# Altium project roach2_project rev2.PrjPCB (part 4 of 13)

## Sheet ppc_extbus.SchDoc: PowerPC External Bus Interfaces
size A3; Date: DO NOT USE, RATHER USE PROJ OPTIONS; DrawnBy: DO NOT USE, RATHER USE PROJ OPTIONS; Engineer: DO NOT USE, RATHER USE PROJ OPTIONS; Organization: DO NOT USE, RATHER USE PROJ OPTIONS; DocumentNumber: DO NOT USE, RATHER USE PROJ OPTIONS; Revision: DO NOT USE, RATHER USE PROJ OPTIONS; SheetNumber: 6; SheetTotal: 27; SCH_Sheet_Filename: ppc_extbus.SchDoc; CurrentTime: DO NOT USE, RATHER USE PROJ OPTIONS; Time: DO NOT USE, RATHER USE PROJ OPTIONS; DocumentFullPathAndName: DO NOT USE, RATHER USE PROJ OPTIONS; DocumentName: DO NOT USE, RATHER USE PROJ OPTIONS; ModifiedDate: DO NOT USE, RATHER USE PROJ OPTIONS; ImagePath: DO NOT USE, RATHER USE PROJ OPTIONS
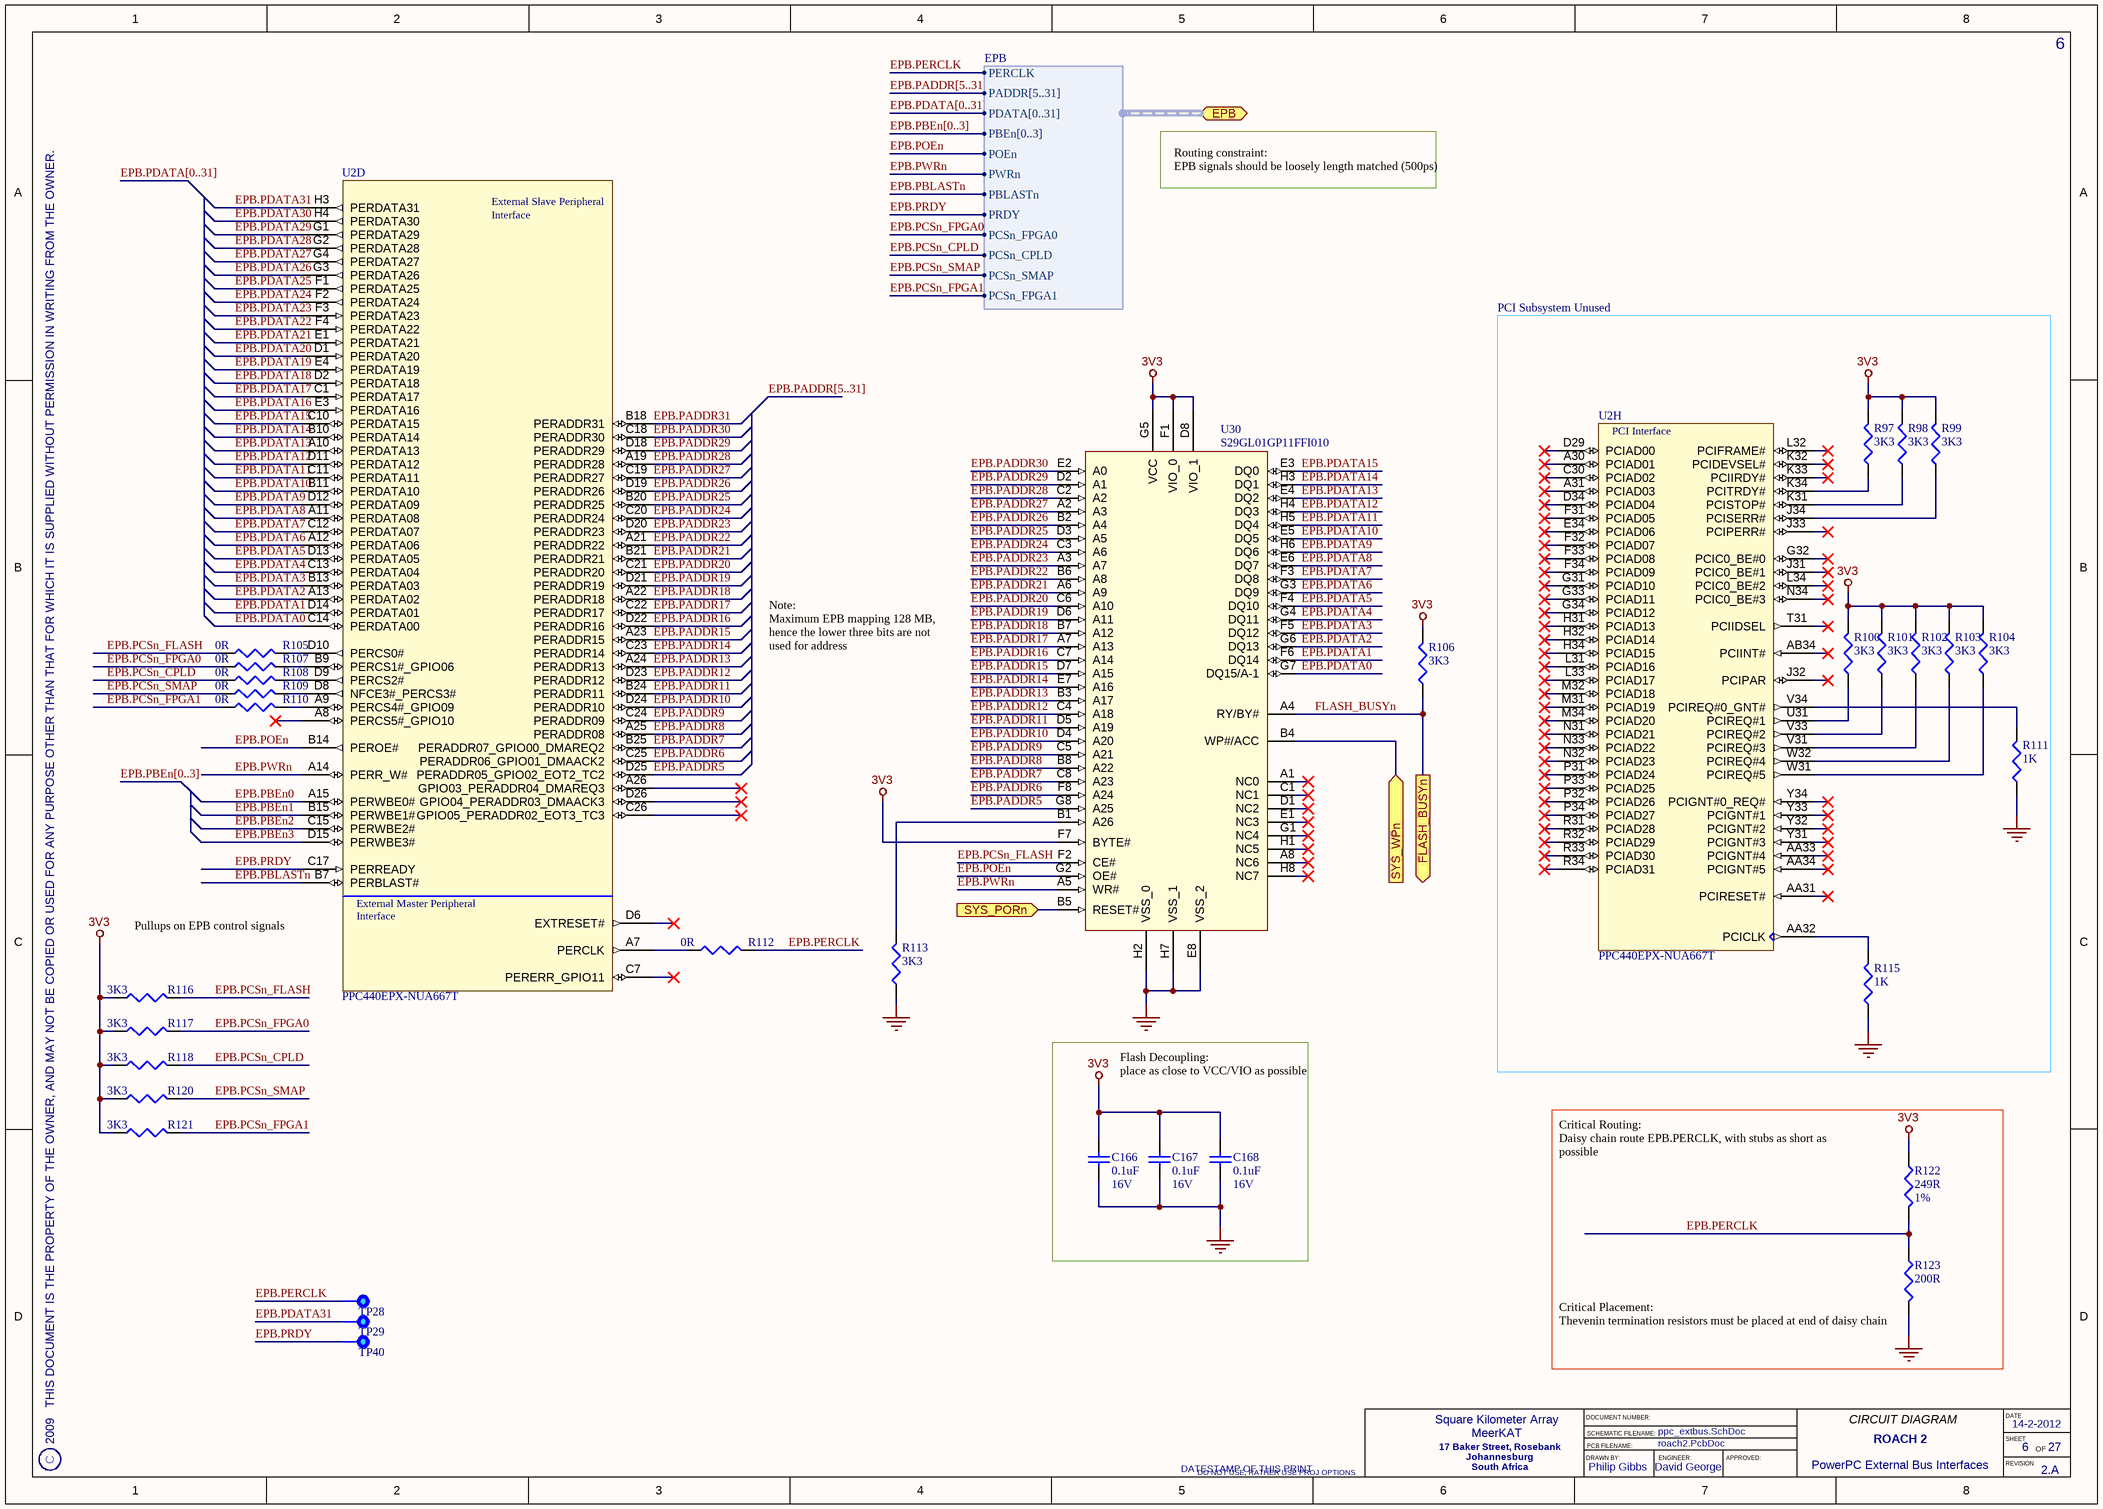
[diagram p7: ppc_extbus.SchDoc]

### Parts
C166  Rating: 16V  [CAPC1005X60L]  (hidden comment: 0.1uF)
C167  Rating: 16V  [CAPC1005X60L]  (hidden comment: 0.1uF)
C168  Rating: 16V  [CAPC1005X60L]  (hidden comment: 0.1uF)
R97  3K3  [RESC1005X40L]
R98  3K3  [RESC1005X40L]
R99  3K3  [RESC1005X40L]
R100  3K3  [RESC1005X40L]
R101  3K3  [RESC1005X40L]
R102  3K3  [RESC1005X40L]
R103  3K3  [RESC1005X40L]
R104  3K3  [RESC1005X40L]
R105  0R  [RESC1005X40L]
R106  3K3  [RESC1005X40L]
R107  0R  [RESC1005X40L]
R108  0R  [RESC1005X40L]
R109  0R  [RESC1005X40L]
R110  0R  [RESC1005X40L]
R111  1K  [RESC1005X40L]
R112  0R  [RESC1005X40L]
R113  3K3  [RESC1005X40L]
R115  1K  [RESC1005X40L]
R116  3K3  [RESC1005X40L]
R117  3K3  [RESC1005X40L]
R118  3K3  [RESC1005X40L]
R120  3K3  [RESC1005X40L]
R121  3K3  [RESC1005X40L]
R122  Tolerance: 1%  [RESC1005X40L]  (hidden comment: 249R)
R123  200R  [RESC1005X40L]
TP28  Testpoint  [TP100]  (value not drawn)  (no BOM)
TP29  Testpoint  [TP100]  (value not drawn)  (no BOM)
TP40  Testpoint  [TP100]  (value not drawn)  (no BOM)
U2  PPC440EPX-NUA667T  [TE-PBGA680]  (parts D,H of 11)
U30  S29GL01GP11FFI010  [LAA064]

### Blocks framed on the sheet
PCI Subsystem Unused: R97-R104 R111 R115 U2

### Ports
EPB (harness EPB), FLASH_BUSYn (out), SYS_PORn (in), SYS_WPn (in)

### Harnesses
EPB: PERCLK, PADDR[5..31], PDATA[0..31], PBEn[0..3], POEn, PWRn, PBLASTn, PRDY, PCSn_FPGA0, PCSn_CPLD, PCSn_SMAP, PCSn_FPGA1

### Nets
3V3: C166.2 C167.2 C168.2 R97.2 R98.2 R99.2 R100.2 R101.2 R102.2 R103.2 R104.2 R106.2 R116.1 R117.1 R118.1 R120.1 R121.1 R122.1 U30.D8(VIO_1) U30.F1(VIO_0) U30.F7(BYTE#) U30.G5(VCC)
GND: C166.1 C167.1 C168.1 R111.1 R113.1 R115.1 R123.2 U30.E8(VSS_2) U30.H2(VSS_0) U30.H7(VSS_1)
EPB.PADDR5: U2.D25(PERADDR05_GPIO02_EOT2_TC2) U30.G8(A25)
EPB.PADDR6: U2.C25(PERADDR06_GPIO01_DMAACK2) U30.F8(A24)
EPB.PADDR7: U2.B25(PERADDR07_GPIO00_DMAREQ2) U30.C8(A23)
EPB.PADDR8: U2.A25(PERADDR08) U30.B8(A22)
EPB.PADDR9: U2.C24(PERADDR09) U30.C5(A21)
EPB.PADDR10: U2.D24(PERADDR10) U30.D4(A20)
EPB.PADDR11: U2.B24(PERADDR11) U30.D5(A19)
EPB.PADDR12: U2.D23(PERADDR12) U30.C4(A18)
EPB.PADDR13: U2.A24(PERADDR13) U30.B3(A17)
EPB.PADDR14: U2.C23(PERADDR14) U30.E7(A16)
EPB.PADDR15: U2.A23(PERADDR15) U30.D7(A15)
EPB.PADDR16: U2.D22(PERADDR16) U30.C7(A14)
EPB.PADDR17: U2.C22(PERADDR17) U30.A7(A13)
EPB.PADDR18: U2.A22(PERADDR18) U30.B7(A12)
EPB.PADDR19: U2.D21(PERADDR19) U30.D6(A11)
EPB.PADDR20: U2.C21(PERADDR20) U30.C6(A10)
EPB.PADDR21: U2.B21(PERADDR21) U30.A6(A9)
EPB.PADDR22: U2.A21(PERADDR22) U30.B6(A8)
EPB.PADDR23: U2.D20(PERADDR23) U30.A3(A7)
EPB.PADDR24: U2.C20(PERADDR24) U30.C3(A6)
EPB.PADDR25: U2.B20(PERADDR25) U30.D3(A5)
EPB.PADDR26: U2.D19(PERADDR26) U30.B2(A4)
EPB.PADDR27: U2.C19(PERADDR27) U30.A2(A3)
EPB.PADDR28: U2.A19(PERADDR28) U30.C2(A2)
EPB.PADDR29: U2.D18(PERADDR29) U30.D2(A1)
EPB.PADDR30: U2.C18(PERADDR30) U30.E2(A0)
EPB.PADDR31: U2.B18(PERADDR31)
EPB.PBEn0: U2.A15(PERWBE0#)
EPB.PBEn1: U2.B15(PERWBE1#)
EPB.PBEn2: U2.C15(PERWBE2#)
EPB.PBEn3: U2.D15(PERWBE3#)
EPB.PBLASTn: U2.B7(PERBLAST#) ; port EPB.PBLASTn
EPB.PCSn_CPLD: R108.1 R118.2 ; port EPB.PCSn_CPLD
EPB.PCSn_FLASH: R105.1 R116.2 U30.F2(CE#)
EPB.PCSn_FPGA0: R107.1 R117.2 ; port EPB.PCSn_FPGA0
EPB.PCSn_FPGA1: R110.1 R121.2 ; port EPB.PCSn_FPGA1
EPB.PCSn_SMAP: R109.1 R120.2 ; port EPB.PCSn_SMAP
EPB.PDATA0: U2.C14(PERDATA00) U30.G7(DQ15/A-1)
EPB.PDATA1: U2.D14(PERDATA01) U30.F6(DQ14)
EPB.PDATA2: U2.A13(PERDATA02) U30.G6(DQ13)
EPB.PDATA3: U2.B13(PERDATA03) U30.F5(DQ12)
EPB.PDATA4: U2.C13(PERDATA04) U30.G4(DQ11)
EPB.PDATA5: U2.D13(PERDATA05) U30.F4(DQ10)
EPB.PDATA6: U2.A12(PERDATA06) U30.G3(DQ9)
EPB.PDATA7: U2.C12(PERDATA07) U30.F3(DQ8)
EPB.PDATA8: U2.A11(PERDATA08) U30.E6(DQ7)
EPB.PDATA9: U2.D12(PERDATA09) U30.H6(DQ6)
EPB.PDATA10: U2.B11(PERDATA10) U30.E5(DQ5)
EPB.PDATA11: U2.C11(PERDATA11) U30.H5(DQ4)
EPB.PDATA12: U2.D11(PERDATA12) U30.H4(DQ3)
EPB.PDATA13: U2.A10(PERDATA13) U30.E4(DQ2)
EPB.PDATA14: U2.B10(PERDATA14) U30.H3(DQ1)
EPB.PDATA15: U2.C10(PERDATA15) U30.E3(DQ0)
EPB.PDATA16: U2.E3(PERDATA16)
EPB.PDATA17: U2.C1(PERDATA17)
EPB.PDATA18: U2.D2(PERDATA18)
EPB.PDATA19: U2.E4(PERDATA19)
EPB.PDATA20: U2.D1(PERDATA20)
EPB.PDATA21: U2.E1(PERDATA21)
EPB.PDATA22: U2.F4(PERDATA22)
EPB.PDATA23: U2.F3(PERDATA23)
EPB.PDATA24: U2.F2(PERDATA24)
EPB.PDATA25: U2.F1(PERDATA25)
EPB.PDATA26: U2.G3(PERDATA26)
EPB.PDATA27: U2.G4(PERDATA27)
EPB.PDATA28: U2.G2(PERDATA28)
EPB.PDATA29: U2.G1(PERDATA29)
EPB.PDATA30: U2.H4(PERDATA30)
EPB.PDATA31: TP29.1 U2.H3(PERDATA31)
EPB.PERCLK: R112.2 R122.2 R123.1 TP28.1 ; port EPB.PERCLK
EPB.POEn: U2.B14(PEROE#) U30.G2(OE#) ; port EPB.POEn
EPB.PRDY: TP40.1 U2.C17(PERREADY) ; port EPB.PRDY
EPB.PWRn: U2.A14(PERR_W#) U30.A5(WR#) ; port EPB.PWRn
FLASH_BUSYn: R106.1 U30.A4(RY/BY#) ; port FLASH_BUSYn
SYS_PORn: U30.B5(RESET#) ; port SYS_PORn
SYS_WPn: U30.B4(WP#/ACC) ; port SYS_WPn
NetR97_1: R97.1 U2.K34(PCITRDY#)
NetR98_1: R98.1 U2.K31(PCISTOP#)
NetR99_1: R99.1 U2.J34(PCISERR#)
NetR100_1: R100.1 U2.U31(PCIREQ#1)
NetR101_1: R101.1 U2.V33(PCIREQ#2)
NetR102_1: R102.1 U2.V31(PCIREQ#3)
NetR103_1: R103.1 U2.W32(PCIREQ#4)
NetR104_1: R104.1 U2.W31(PCIREQ#5)
NetR105_2: R105.2 U2.D10(PERCS0#)
NetR107_2: R107.2 U2.B9(PERCS1#_GPIO06)
NetR108_2: R108.2 U2.D9(PERCS2#)
NetR109_2: R109.2 U2.D8(NFCE3#_PERCS3#)
NetR110_2: R110.2 U2.A9(PERCS4#_GPIO09)
NetR111_2: R111.2 U2.V34(PCIREQ#0_GNT#)
NetR112_1: R112.1 U2.A7(PERCLK)
NetR113_2: R113.2 U30.B1(A26)
NetR115_2: R115.2 U2.AA32(PCICLK)

Not connected (* = marked no-connect by the designer): U2 A8(PERCS5#_GPIO10)* A26(GPIO03_PERADDR04_DMAREQ3)* A30(PCIAD01)* A31(PCIAD03)* AA31(PCIRESET#)* AA33(PCIGNT#4)* AA34(PCIGNT#5)* AB34(PCIINT#)* C7(PERERR_GPIO11)* C26(GPIO05_PERADDR02_EOT3_TC3)* C30(PCIAD02)* D6(EXTRESET#)* D26(GPIO04_PERADDR03_DMAACK3)* D29(PCIAD00)* D34(PCIAD04)* E34(PCIAD06)* F31(PCIAD05)* F32(PCIAD07)* F33(PCIAD08)* F34(PCIAD09)* G31(PCIAD10)* G32(PCIC0_BE#0)* G33(PCIAD11)* G34(PCIAD12)* H31(PCIAD13)* H32(PCIAD14)* H34(PCIAD15)* J31(PCIC0_BE#1)* J32(PCIPAR)* J33(PCIPERR#)* K32(PCIDEVSEL#)* K33(PCIIRDY#)* L31(PCIAD16)* L32(PCIFRAME#)* L33(PCIAD17)* L34(PCIC0_BE#2)* M31(PCIAD19)* M32(PCIAD18)* M34(PCIAD20)* N31(PCIAD21)* N32(PCIAD23)* N33(PCIAD22)* N34(PCIC0_BE#3)* P31(PCIAD24)* P32(PCIAD26)* P33(PCIAD25)* P34(PCIAD27)* R31(PCIAD28)* R32(PCIAD29)* R33(PCIAD30)* R34(PCIAD31)* T31(PCIIDSEL)* Y31(PCIGNT#3)* Y32(PCIGNT#2)* Y33(PCIGNT#1)* Y34(PCIGNT#0_REQ#)*; U30 A1(NC0)* A8(NC6)* C1(NC1)* D1(NC2)* E1(NC3)* G1(NC4)* H1(NC5)* H8(NC7)*

### Buses and harness runs
bus EPB.PADDR[5..31]
bus EPB.PBEn[0..3]
bus EPB.PDATA[0..31]

### Notes on the sheet
- Routing constraint:
  EPB signals should be loosely length matched (500ps)
- Note:
  Maximum EPB mapping 128 MB,
  hence the lower three bits are not
  used for address
- (near U2) Pullups on EPB control signals
- Flash Decoupling:
  place as close to VCC/VIO as possible
- (near R122) Critical Routing:
  Daisy chain route EPB.PERCLK, with stubs as short as possible
- (near R123) Critical Placement:
  Thevenin termination resistors must be placed at end of daisy chain
- 2009   THIS DOCUMENT IS THE PROPERTY OF THE OWNER, AND MAY NOT BE COPIED OR USED FOR ANY PURPOSE OTHER THAN THAT FOR WHICH IT IS SUPPLIED WITHOUT PERMISSION IN WRITING FROM THE OWNER.
- C
- DATESTAMP OF THIS PRINT
- DRAWN BY:
- DOCUMENT NUMBER:
- SCHEMATIC FILENAME:
- PCB FILENAME:
- ENGINEER:
- APPROVED:
- CIRCUIT DIAGRAM
- DATE
- SHEET
- REVISION
- OF
- (in symbol IC-CPU-1, part D) External Slave Peripheral; Interface; External Master Peripheral
- (in symbol IC-CPU-1, part H) PCI Interface

### Library data of the parts
C166-C168 = CAP-CER-1: 0.1uF, Ceramic Capacitor; Manufacturer: VENKEL; PartNum: C0402X7R160-104KN; Tolerance: 10%; Dielectric: X7R; POD number: CAP-CER-1; RoHS: Y; Value: 0.1uF; Sort Value: 0.1; Category: Capacitors; Subcategory: Ceramic
R97-R104 R106 R113 R116-R118 R120 R121 = RES-TF-7: 3K3, 1.1mm x 0.5mm, Thick Film Resistor; Manufacturer: ROYALOHM; PartNum: 0402WGJ0332T1E; Tolerance: 5%; Rating: 0.0625W; POD number: RES-TF-7; Value: 3K3; Sort Value: 3300; Category: Resistors; Subcategory: ThickFilm; HelpURL: *.pdf
R105 R107-R110 R112 = RES-TF-0: 0R, 1.1mm x 0.5mm, Thick Film Resistor; Manufacturer: ROYALOHM; PartNum: 0402WG00000T1E; Tolerance: 0%; Rating: 0.0625W; POD number: RES-TF-0; Value: 0R; Sort Value: 0; Category: Resistors; Subcategory: ThickFilm; HelpURL: *.pdf
R111 R115 = RES-TF-8: 1K, 1.1mm x 0.5mm, Thick Film Resistor; Manufacturer: ROYALOHM; PartNum: 0402WGJ0102T1E; Tolerance: 5%; Rating: 0.0625W; POD number: RES-TF-8; Value: 1K; Sort Value: 1000; Category: Resistors; Subcategory: ThickFilm; HelpURL: *.pdf
R122 = RES-TF-15: 249R, 1.1mm x 0.5mm, Thick Film Resistor; Manufacturer: ROYALOHM; PartNum: 0402WGF2490T1E; Rating: 0.0625W; POD number: RES-TF-15; Value: 249R; Sort Value: 249; Category: Resistors; Subcategory: ThickFilm; HelpURL: *.pdf
R123 = RES-TF-19: 200R, 1.1mm x 0.5mm, Thick Film Resistor; Manufacturer: ROYALOHM; PartNum: 0402WGF0201T1E; Tolerance: 1%; Rating: 0.0625W; POD number: RES-TF-19; Value: 200R; Sort Value: 200; Category: Resistors; Subcategory: ThickFilm; HelpURL: *.pdf
TP28 TP29 TP40 = ELMECH-TP-0: 1mm Diameter, through-hole, Circular Test-point; POD number: ELMECH-TP-0; RoHS: Y; Category: ELMECH; Subcategory: Test Points
U2 = IC-CPU-1: 667MHz, non-RoHS, PPC440EPx uProcessor; Manufacturer: Applied Micro; POD number: IC-CPU-1; PartNum: PPC440EPX-NUA667T; RoHS: Y; Category: IC; Subcategory: CPU
U30 = IC-MEM-0: 3V, 1 Gigabit NOR Flash; Manufacturer: Spansion; POD number: IC-MEM-0; PartNum: S29GL01GP11FFI010; RoHS: Y; Category: IC; Subcategory: Memory

## Sheet ppc_net.SchDoc: PowePC Gigabit Ethernet
size A3; Date: DO NOT USE, RATHER USE PROJ OPTIONS; DrawnBy: DO NOT USE, RATHER USE PROJ OPTIONS; Engineer: DO NOT USE, RATHER USE PROJ OPTIONS; Organization: DO NOT USE, RATHER USE PROJ OPTIONS; DocumentNumber: DO NOT USE, RATHER USE PROJ OPTIONS; Revision: DO NOT USE, RATHER USE PROJ OPTIONS; SheetNumber: 11; SheetTotal: 29; SCH_Sheet_Filename: ppc_net.SchDoc; CurrentTime: DO NOT USE, RATHER USE PROJ OPTIONS; Time: DO NOT USE, RATHER USE PROJ OPTIONS; DocumentFullPathAndName: DO NOT USE, RATHER USE PROJ OPTIONS; DocumentName: DO NOT USE, RATHER USE PROJ OPTIONS; ModifiedDate: DO NOT USE, RATHER USE PROJ OPTIONS; ImagePath: DO NOT USE, RATHER USE PROJ OPTIONS
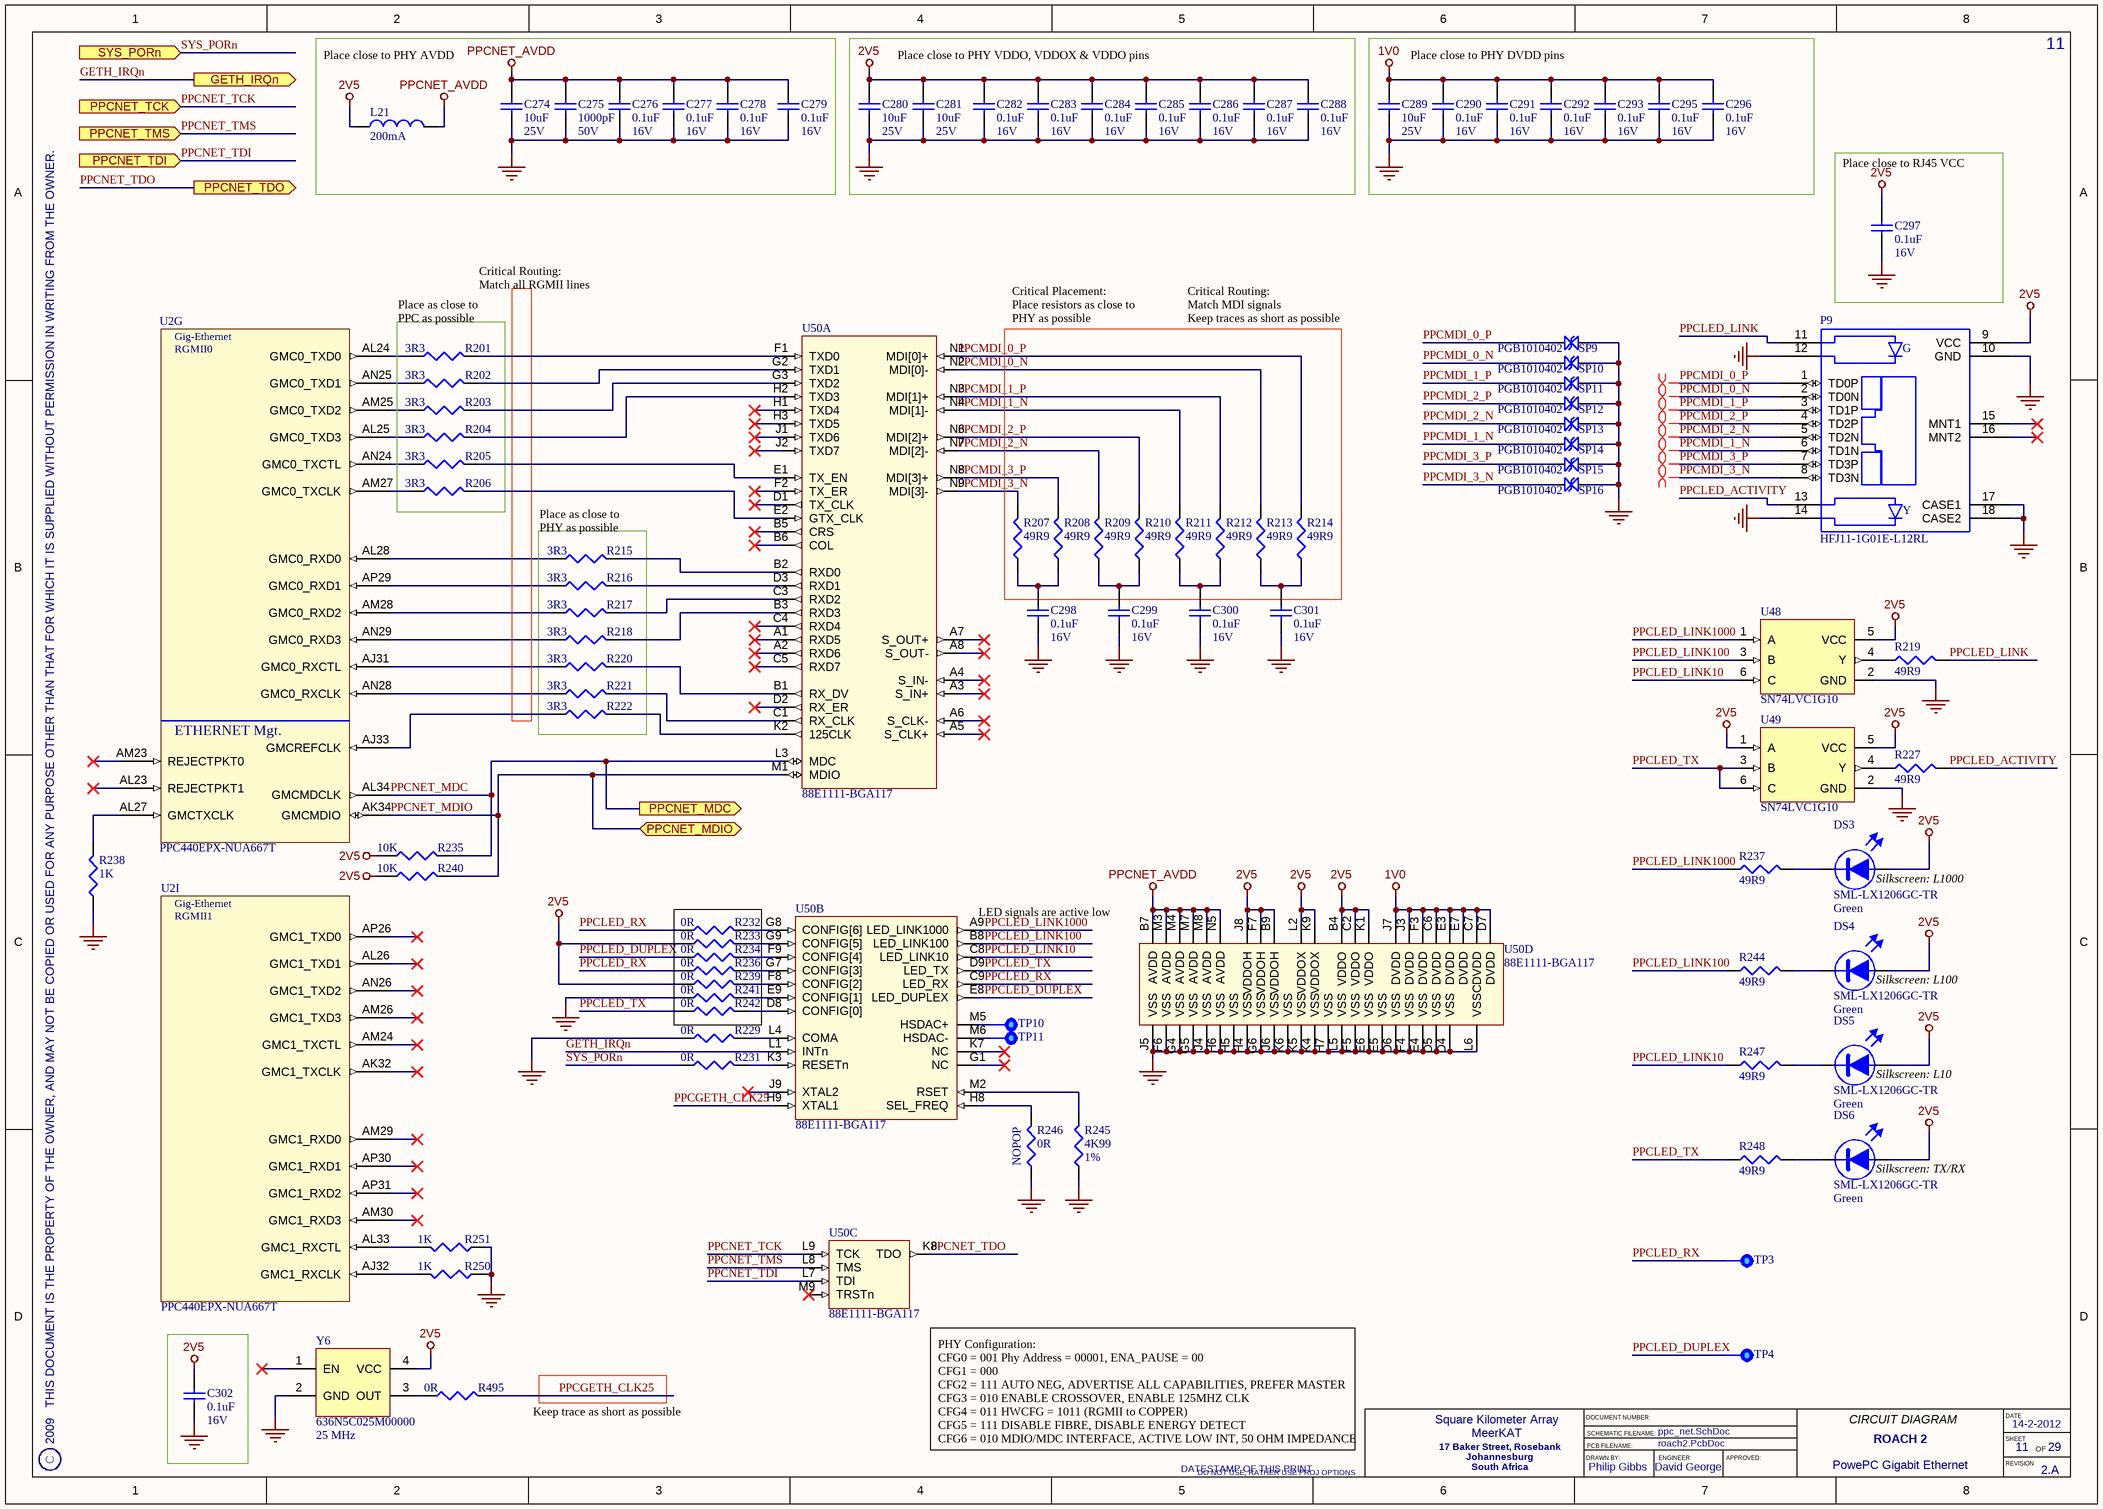
[diagram p8: ppc_net.SchDoc]

### Parts
C274  Rating: 25V  [CAPC3225X200L]  (hidden comment: 10uF)
C275  Rating: 50V  [CAPC1005X55L]  (hidden comment: 1000pF)
C276  Rating: 16V  [CAPC1005X60L]  (hidden comment: 0.1uF)
C277  Rating: 16V  [CAPC1005X60L]  (hidden comment: 0.1uF)
C278  Rating: 16V  [CAPC1005X60L]  (hidden comment: 0.1uF)
C279  Rating: 16V  [CAPC1005X60L]  (hidden comment: 0.1uF)
C280  Rating: 25V  [CAPC3225X200L]  (hidden comment: 10uF)
C281  Rating: 25V  [CAPC3225X200L]  (hidden comment: 10uF)
C282  Rating: 16V  [CAPC1005X60L]  (hidden comment: 0.1uF)
C283  Rating: 16V  [CAPC1005X60L]  (hidden comment: 0.1uF)
C284  Rating: 16V  [CAPC1005X60L]  (hidden comment: 0.1uF)
C285  Rating: 16V  [CAPC1005X60L]  (hidden comment: 0.1uF)
C286  Rating: 16V  [CAPC1005X60L]  (hidden comment: 0.1uF)
C287  Rating: 16V  [CAPC1005X60L]  (hidden comment: 0.1uF)
C288  Rating: 16V  [CAPC1005X60L]  (hidden comment: 0.1uF)
C289  Rating: 25V  [CAPC3225X200L]  (hidden comment: 10uF)
C290  Rating: 16V  [CAPC1005X60L]  (hidden comment: 0.1uF)
C291  Rating: 16V  [CAPC1005X60L]  (hidden comment: 0.1uF)
C292  Rating: 16V  [CAPC1005X60L]  (hidden comment: 0.1uF)
C293  Rating: 16V  [CAPC1005X60L]  (hidden comment: 0.1uF)
C295  Rating: 16V  [CAPC1005X60L]  (hidden comment: 0.1uF)
C296  Rating: 16V  [CAPC1005X60L]  (hidden comment: 0.1uF)
C297  Rating: 16V  [CAPC1005X60L]  (hidden comment: 0.1uF)
C298  Rating: 16V  [CAPC1005X60L]  (hidden comment: 0.1uF)
C299  Rating: 16V  [CAPC1005X60L]  (hidden comment: 0.1uF)
C300  Rating: 16V  [CAPC1005X60L]  (hidden comment: 0.1uF)
C301  Rating: 16V  [CAPC1005X60L]  (hidden comment: 0.1uF)
C302  Rating: 16V  [CAPC1005X60L]  (hidden comment: 0.1uF)
DS3  SML-LX1206GC-TR  Colour: Green  [LEDC3216X120N]
DS4  SML-LX1206GC-TR  Colour: Green  [LEDC3216X120N]
DS5  SML-LX1206GC-TR  Colour: Green  [LEDC3216X120N]
DS6  SML-LX1206GC-TR  Colour: Green  [LEDC3216X120N]
L21  Rating: 200mA  [INDC2012X130L]  (hidden comment: 600R)
P9  HFJ11-1G01E-L12RL  [HALO_HFJ11-1G02E-L55]
R201  3R3  [RESC1005X40L]
R202  3R3  [RESC1005X40L]
R203  3R3  [RESC1005X40L]
R204  3R3  [RESC1005X40L]
R205  3R3  [RESC1005X40L]
R206  3R3  [RESC1005X40L]
R207  49R9  [RESC1005X40L]
R208  49R9  [RESC1005X40L]
R209  49R9  [RESC1005X40L]
R210  49R9  [RESC1005X40L]
R211  49R9  [RESC1005X40L]
R212  49R9  [RESC1005X40L]
R213  49R9  [RESC1005X40L]
R214  49R9  [RESC1005X40L]
R215  3R3  [RESC1005X40L]
R216  3R3  [RESC1005X40L]
R217  3R3  [RESC1005X40L]
R218  3R3  [RESC1005X40L]
R219  49R9  [RESC1005X40L]
R220  3R3  [RESC1005X40L]
R221  3R3  [RESC1005X40L]
R222  3R3  [RESC1005X40L]
R227  49R9  [RESC1005X40L]
R229  0R  [RESC1005X40L]
R231  0R  [RESC1005X40L]
R232  0R  [RESC1005X40L]
R233  0R  [RESC1005X40L]
R234  0R  [RESC1005X40L]
R235  10K  [RESC1005X40L]
R236  0R  [RESC1005X40L]
R237  49R9  [RESC1005X40L]
R238  1K  [RESC1005X40L]
R239  0R  [RESC1005X40L]
R240  10K  [RESC1005X40L]
R241  0R  [RESC1005X40L]
R242  0R  [RESC1005X40L]
R244  49R9  [RESC1005X40L]
R245  Tolerance: 1%  [RESC1005X40L]  (hidden comment: 4K99)
R246  0R  [RESC1005X40L]
R247  49R9  [RESC1005X40L]
R248  49R9  [RESC1005X40L]
R250  1K  [RESC1005X40L]
R251  1K  [RESC1005X40L]
R495  0R  [RESC1005X40L]
SP9  PGB1010402  [PGB1010402]
SP10  PGB1010402  [PGB1010402]
SP11  PGB1010402  [PGB1010402]
SP12  PGB1010402  [PGB1010402]
SP13  PGB1010402  [PGB1010402]
SP14  PGB1010402  [PGB1010402]
SP15  PGB1010402  [PGB1010402]
SP16  PGB1010402  [PGB1010402]
TP3  Testpoint  [TP100]  (value not drawn)  (no BOM)
TP4  Testpoint  [TP100]  (value not drawn)  (no BOM)
TP10  Testpoint  [TP100]  (value not drawn)  (no BOM)
TP11  Testpoint  [TP100]  (value not drawn)  (no BOM)
U2  PPC440EPX-NUA667T  [TE-PBGA680]  (parts G,I of 11)
U48  SN74LVC1G10  [SOT23-6]
U49  SN74LVC1G10  [SOT23-6]
U50  88E1111-BGA117  [BGA117C100P13X9_1400X1000X154]  (parts A,B,C,D of 4)
Y6  Frequency: 25 MHz  [636XXXXXXMXXXXX]  (hidden comment: 636N5C025M00000)

### Ports
GETH_IRQn (out), PPCNET_MDC (out), PPCNET_MDIO (bidir), PPCNET_TCK (in), PPCNET_TDI (in), PPCNET_TDO (out), PPCNET_TMS (in), SYS_PORn (in)

### Nets
1V0: C289.2 C290.2 C291.2 C292.2 C293.2 C295.2 C296.2 U50.C6(DVDD) U50.C7(DVDD) U50.D7(DVDD) U50.E3(DVDD) U50.E7(DVDD) U50.F3(DVDD) U50.J3(DVDD) U50.J7(DVDD)
2V5: C280.2 C281.2 C282.2 C283.2 C284.2 C285.2 C286.2 C287.2 C288.2 C297.2 C302.2 DS3.2(A) DS4.2(A) DS5.2(A) DS6.2(A) L21.1 P9.9(VCC) R233.1 R235.1 R239.1 R240.1 U48.5(VCC) U49.1(A) U49.5(VCC) U50.B4(VDDO) U50.B9(VDDOH) U50.C2(VDDO) U50.F7(VDDOH) U50.J8(VDDOH) U50.K1(VDDO) U50.K9(VDDOX) U50.L2(VDDOX) Y6.4(VCC)
GND: C274.1 C275.1 C276.1 C277.1 C278.1 C279.1 C280.1 C281.1 C282.1 C283.1 C284.1 C285.1 C286.1 C287.1 C288.1 C289.1 C290.1 C291.1 C292.1 C293.1 C295.1 C296.1 C297.1 C298.2 C299.2 C300.2 C301.2 C302.1 P9.10(GND) P9.12(R1_YA_GC) P9.14(L1_YA_GC) P9.17(CASE1) P9.18(CASE2) R229.1 R238.1 R241.1 R245.1 R246.1 R250.1 R251.1 SP9.1(A) SP10.1(A) SP11.1(A) SP12.1(A) SP13.1(A) SP14.1(A) SP15.1(A) SP16.1(A) U48.2(GND) U49.2(GND) U50.D4(VSS) U50.D5(VSS) U50.D6(VSS) U50.E4(VSS) U50.E5(VSS) U50.E6(VSS) U50.F4(VSS) U50.F5(VSS) U50.F6(VSS) U50.G4(VSS) U50.G5(VSS) U50.G6(VSS) U50.H4(VSS) U50.H5(VSS) U50.H6(VSS) U50.H7(VSS) U50.J4(VSS) U50.J5(VSS) U50.J6(VSS) U50.K4(VSS) U50.K5(VSS) U50.K6(VSS) U50.L5(VSS) U50.L6(VSSC) Y6.2(GND)
PPCNET_AVDD: C274.2 C275.2 C276.2 C277.2 C278.2 C279.2 L21.2 U50.B7(AVDD) U50.M3(AVDD) U50.M4(AVDD) U50.M7(AVDD) U50.M8(AVDD) U50.N5(AVDD)
GETH_IRQn: U50.L1(INTn) ; port GETH_IRQn
PPCGETH_CLK25: R495.2 U50.H9(XTAL1)
PPCLED_ACTIVITY: P9.13(L1_YC_GA) R227.2
PPCLED_DUPLEX: R234.1 TP4.1 U50.E8(LED_DUPLEX)
PPCLED_LINK: P9.11(R1_YC_GA) R219.2
PPCLED_LINK10: R247.1 U48.6(C) U50.C8(LED_LINK10)
PPCLED_LINK100: R244.1 U48.3(B) U50.B8(LED_LINK100)
PPCLED_LINK1000: R237.1 U48.1(A) U50.A9(LED_LINK1000)
PPCLED_RX: R232.1 R236.1 TP3.1 U50.C9(LED_RX)
PPCLED_TX: R242.1 R248.1 U49.3(B) U49.6(C) U50.D9(LED_TX)
PPCMDI_0_N: P9.2(TD0N) R213.2 SP10.2(B) U50.N2(MDI[0]-)
PPCMDI_0_P: P9.1(TD0P) R214.2 SP9.2(B) U50.N1(MDI[0]+)
PPCMDI_1_N: P9.6(TD1N) R211.2 SP14.2(B) U50.N4(MDI[1]-)
PPCMDI_1_P: P9.3(TD1P) R212.2 SP11.2(B) U50.N3(MDI[1]+)
PPCMDI_2_N: P9.5(TD2N) R209.2 SP13.2(B) U50.N7(MDI[2]-)
PPCMDI_2_P: P9.4(TD2P) R210.2 SP12.2(B) U50.N6(MDI[2]+)
PPCMDI_3_N: P9.8(TD3N) R207.2 SP16.2(B) U50.N9(MDI[3]-)
PPCMDI_3_P: P9.7(TD3P) R208.2 SP15.2(B) U50.N8(MDI[3]+)
PPCNET_MDC: R235.2 U2.AL34(GMCMDCLK) U50.L3(MDC) ; port PPCNET_MDC
PPCNET_MDIO: R240.2 U2.AK34(GMCMDIO) U50.M1(MDIO) ; port PPCNET_MDIO
PPCNET_TCK: U50.L9(TCK) ; port PPCNET_TCK
PPCNET_TDI: U50.L7(TDI) ; port PPCNET_TDI
PPCNET_TDO: U50.K8(TDO) ; port PPCNET_TDO
PPCNET_TMS: U50.L8(TMS) ; port PPCNET_TMS
SYS_PORn: R231.1 ; port SYS_PORn
NetC298_1: C298.1 R207.1 R208.1
NetC299_1: C299.1 R209.1 R210.1
NetC300_1: C300.1 R211.1 R212.1
NetC301_1: C301.1 R213.1 R214.1
NetDS3_1: DS3.1(K) R237.2
NetDS4_1: DS4.1(K) R244.2
NetDS5_1: DS5.1(K) R247.2
NetDS6_1: DS6.1(K) R248.2
NetR201_1: R201.1 U2.AL24(GMC0_TXD0)
NetR201_2: R201.2 U50.F1(TXD0)
NetR202_1: R202.1 U2.AN25(GMC0_TXD1)
NetR202_2: R202.2 U50.G2(TXD1)
NetR203_1: R203.1 U2.AM25(GMC0_TXD2)
NetR203_2: R203.2 U50.G3(TXD2)
NetR204_1: R204.1 U2.AL25(GMC0_TXD3)
NetR204_2: R204.2 U50.H2(TXD3)
NetR205_1: R205.1 U2.AN24(GMC0_TXCTL)
NetR205_2: R205.2 U50.E1(TX_EN)
NetR206_1: R206.1 U2.AM27(GMC0_TXCLK)
NetR206_2: R206.2 U50.E2(GTX_CLK)
NetR215_1: R215.1 U2.AL28(GMC0_RXD0)
NetR215_2: R215.2 U50.B2(RXD0)
NetR216_1: R216.1 U2.AP29(GMC0_RXD1)
NetR216_2: R216.2 U50.D3(RXD1)
NetR217_1: R217.1 U2.AM28(GMC0_RXD2)
NetR217_2: R217.2 U50.C3(RXD2)
NetR218_1: R218.1 U2.AN29(GMC0_RXD3)
NetR218_2: R218.2 U50.B3(RXD3)
NetR219_1: R219.1 U48.4(Y)
NetR220_1: R220.1 U2.AJ31(GMC0_RXCTL)
NetR220_2: R220.2 U50.B1(RX_DV)
NetR221_1: R221.1 U2.AN28(GMC0_RXCLK)
NetR221_2: R221.2 U50.C1(RX_CLK)
NetR222_1: R222.1 U2.AJ33(GMCREFCLK)
NetR222_2: R222.2 U50.K2(125CLK)
NetR227_1: R227.1 U49.4(Y)
NetR229_2: R229.2 U50.L4(COMA)
NetR231_2: R231.2 U50.K3(RESETn)
NetR232_2: R232.2 U50.G8(CONFIG[6])
NetR233_2: R233.2 U50.G9(CONFIG[5])
NetR234_2: R234.2 U50.F9(CONFIG[4])
NetR236_2: R236.2 U50.G7(CONFIG[3])
NetR238_2: R238.2 U2.AL27(GMCTXCLK)
NetR239_2: R239.2 U50.F8(CONFIG[2])
NetR241_2: R241.2 U50.E9(CONFIG[1])
NetR242_2: R242.2 U50.D8(CONFIG[0])
NetR245_2: R245.2 U50.M2(RSET)
NetR246_2: R246.2 U50.H8(SEL_FREQ)
NetR250_2: R250.2 U2.AJ32(GMC1_RXCLK)
NetR251_2: R251.2 U2.AL33(GMC1_RXCTL)
NetR495_1: R495.1 Y6.3(OUT)
NetTP10_1: TP10.1 U50.M5(HSDAC+)
NetTP11_1: TP11.1 U50.M6(HSDAC-)

Not connected (* = marked no-connect by the designer): P9 15(MNT1)* 16(MNT2)*; U2 AK32(GMC1_TXCLK)* AL23(REJECTPKT1)* AL26(GMC1_TXD1)* AM23(REJECTPKT0)* AM24(GMC1_TXCTL)* AM26(GMC1_TXD3)* AM29(GMC1_RXD0)* AM30(GMC1_RXD3)* AN26(GMC1_TXD2)* AP26(GMC1_TXD0)* AP30(GMC1_RXD1)* AP31(GMC1_RXD2)*; U50 A1(RXD5)* A2(RXD6)* A3(S_IN+)* A4(S_IN-)* A5(S_CLK+)* A6(S_CLK-)* A7(S_OUT+)* A8(S_OUT-)* B5(CRS)* B6(COL)* C4(RXD4)* C5(RXD7)* D1(TX_CLK)* D2(RX_ER)* F2(TX_ER)* G1(NC)* H1(TXD4)* H3(TXD5)* J1(TXD6)* J2(TXD7)* J9(XTAL2)* K7(NC)* M9(TRSTn)*; Y6 1(EN)*

### Layout directives
differential pair: PPCMDI_0_N, PPCMDI_0_P, PPCMDI_1_N, PPCMDI_1_P, PPCMDI_2_N, PPCMDI_2_P, PPCMDI_3_N, PPCMDI_3_P

### Notes on the sheet
- Place close to PHY AVDD
- Place close to PHY VDDO, VDDOX & VDDO pins
- Place close to PHY DVDD pins
- (near C297) Place close to RJ45 VCC
- (near R201) Place as close to
  PPC as possible
- Critical Routing:
  Match all RGMII lines
- Critical Placement:
  Place resistors as close to
  PHY as possible
- Critical Routing:
  Match MDI signals
  Keep traces as short as possible
- (near R215) Place as close to
  PHY as possible
- (near U50) LED signals are active low
- (near DS3) Silkscreen: L1000
- (near DS4) Silkscreen: L100
- (near DS5) Silkscreen: L10
- (near R246) NOPOP
- (near DS6) Silkscreen: TX/RX
- Keep trace as short as possible
- (near U50) PHY Configuration:
  CFG0 = 001 Phy Address = 00001, ENA_PAUSE = 00
  CFG1 = 000
  CFG2 = 111 AUTO NEG, ADVERTISE ALL CAPABILITIES, PREFER MASTER
  CFG3 = 010 ENABLE CROSSOVER, ENABLE 125MHZ CLK
  CFG4 = 011 HWCFG = 1011 (RGMII to COPPER)
  CFG5 = 111 DISABLE FIBRE, DISABLE ENERGY DETECT
  CFG6 = 010 MDIO/MDC INTERFACE, ACTIVE LOW INT, 50 OHM IMPEDANCE
- 2009   THIS DOCUMENT IS THE PROPERTY OF THE OWNER, AND MAY NOT BE COPIED OR USED FOR ANY PURPOSE OTHER THAN THAT FOR WHICH IT IS SUPPLIED WITHOUT PERMISSION IN WRITING FROM THE OWNER.
- C
- DATESTAMP OF THIS PRINT
- DRAWN BY:
- DOCUMENT NUMBER:
- SCHEMATIC FILENAME:
- PCB FILENAME:
- ENGINEER:
- APPROVED:
- CIRCUIT DIAGRAM
- DATE
- SHEET
- REVISION
- OF
- (in symbol CONN-PCB-4) G
- (in symbol IC-CPU-1, part G) Gig-Ethernet; RGMII0; ETHERNET Mgt.
- (in symbol IC-CPU-1, part I) Gig-Ethernet; RGMII1

### Library data of the parts
C274 C280 C281 C289 = CAP-CER-5: 10uF, Ceramic Capacitor; Manufacturer: MURATA; PartNum: GRM32DR61E106KA12L; Tolerance: 10%; Dielectric: X5R; POD number: CAP-CER-5; Value: 10uF; RoHS: Y; Sort Value: 100; Category: Capacitors; Subcategory: Ceramic
C275 = CAP-CER-4: 1000pF, Ceramic Capacitor; Manufacturer: MURATA; PartNum: GRM155R61H102KA01D; Tolerance: 10%; Dielectric: X5R; POD number: CAP-CER-4; Value: 1000pF; RoHS: Y; Sort Value: 0.0001; Category: Capacitors; Subcategory: Ceramic
C276-C279 C282-C288 C290-C293 C295-C302 = CAP-CER-1: as C166-C168 on sheet ppc_extbus; POD number: CAP-CER-1; Value: 0.1uF; RoHS: Y; Sort Value: 0.1; Category: Capacitors; Subcategory: Ceramic
DS3-DS6 = OPTO-LED-0: Green, Surface mount, LED, 1206; Manufacturer: LUMEX; Vdrop: 2.2V; Rating: 20mA; POD number: OPTO-LED-0; PartNum: SML-LX1206GC-TR; RoHS: Y; Category: OPTO; Subcategory: LED
L21 = IND-FB-0: 600 Ohm, Chip Ferrite Bead; Manufacturer: Murata; PartNum: BLM21BD601SN1; DC Res: 0.35R; Tolerance: 25%; POD number: IND-FB-0; RoHS: Y; Value: 600R; Sort Value: 600; Category: Inductors; Subcategory: FerriteBead
P9 = CONN-PCB-4: RJ45 with Integrated magnetic and dual LEDs; Manufacturer: HALO; POD number: CONN-PCB-4; PartNum: HFJ11-1G01E-L12RL; RoHS: Y; Category: CONN; Subcategory: PCB
R201-R206 R215-R218 R220-R222 = RES-TF-24: 3R3, 1.1mm x 0.5mm, Thick Film Resistor; Manufacturer: ROYALOHM; PartNum: 0402WGJ330KT1E; Tolerance: 5%; Rating: 0.0625W; POD number: RES-TF-24; Value: 3R3; Sort Value: 3R3; Category: Resistors; Subcategory: ThickFilm; HelpURL: *.pdf
R207-R214 R219 R227 R237 R244 R247 R248 = RES-TF-10: 49R9, 1.1mm x 0.5mm, Thick Film Resistor; Manufacturer: ROYALOHM; PartNum: 0402WGF499JT1E; Tolerance: 1%; Rating: 0.0625W; POD number: RES-TF-10; Value: 49R9; Sort Value: 49.9; Category: Resistors; Subcategory: ThickFilm; HelpURL: *.pdf
R229 R231-R234 R236 R239 R241 R242 R246 R495 = RES-TF-0: as R105 on sheet ppc_extbus; POD number: RES-TF-0; Value: 0R; Sort Value: 0; Category: Resistors; Subcategory: ThickFilm; HelpURL: *.pdf
R235 R240 = RES-TF-5: 10K, 1.1mm x 0.5mm, Thick Film Resistor; Manufacturer: ROYALOHM; PartNum: 0402WGJ0103T1E; Tolerance: 5%; Rating: 0.0625W; POD number: RES-TF-5; Value: 10K; Sort Value: 10000; Category: Resistors; Subcategory: ThickFilm; HelpURL: *.pdf
R238 R250 R251 = RES-TF-8: as R111 on sheet ppc_extbus; POD number: RES-TF-8; Value: 1K; Sort Value: 1000; Category: Resistors; Subcategory: ThickFilm; HelpURL: *.pdf
R245 = RES-TF-13: 4K99, 1.1mm x 0.5mm, Thick Film Resistor; Manufacturer: ROYALOHM; PartNum: 0402WGF4991T1E; Rating: 0.0625W; POD number: RES-TF-13; Value: 4K99; Sort Value: 4990; Category: Resistors; Subcategory: ThickFilm; HelpURL: *.pdf
SP9-SP16 = ELMECH-ESD-3: Surface Mount Polymeric ESD Suppressor in an 0402 package; POD number: ELMECH-ESD-3; PartNum: PGB1010402
TP3 TP4 TP10 TP11 = ELMECH-TP-0: as TP28 on sheet ppc_extbus; POD number: ELMECH-TP-0; RoHS: Y; Category: ELMECH; Subcategory: Test Points
U2 = IC-CPU-1: as U2 on sheet ppc_extbus; POD number: IC-CPU-1; PartNum: PPC440EPX-NUA667T; RoHS: Y; Category: IC; Subcategory: CPU
U48 U49 = IC-LOG-3: Single 3-input Positive-NAND gate; Manufacturer: Texas Instruments; POD number: IC-LOG-3; PartNum: SN74LVC1G10; RoHS: Y; Category: IC; Subcategory: Logic
U50 = IC-PHY-1: Integrated 10/100/1000 Ultra Gigabit Ethernet Transceiver; Manufacturer: Marvell; PartNum: 88E1111-XX-BAB1C000; POD number: IC-PHY-1; RoHS: Y; Category: IC; Subcategory: Network PHY
Y6 = RESN-CLK-5: 25.00 MHz, 2V5, CTS 636 clock oscillator; Stability: 50 PPM; POD number: RESN-CLK-5; PartNum: 636N5C025M00000; Manufacturer: CTS; RoHS: Y; Category: RESN; Subcategory: Clock Oscillators

## Sheet ppc_serial.SchDoc: PowerPC Serial Interfaces
size A3; Date: DO NOT USE, RATHER USE PROJ OPTIONS; DrawnBy: DO NOT USE, RATHER USE PROJ OPTIONS; Engineer: DO NOT USE, RATHER USE PROJ OPTIONS; Organization: DO NOT USE, RATHER USE PROJ OPTIONS; DocumentNumber: DO NOT USE, RATHER USE PROJ OPTIONS; Revision: DO NOT USE, RATHER USE PROJ OPTIONS; SheetNumber: 7; SheetTotal: 29; SCH_Sheet_Filename: ppc_serial.SchDoc; CurrentTime: DO NOT USE, RATHER USE PROJ OPTIONS; Time: DO NOT USE, RATHER USE PROJ OPTIONS; DocumentFullPathAndName: DO NOT USE, RATHER USE PROJ OPTIONS; DocumentName: DO NOT USE, RATHER USE PROJ OPTIONS; ModifiedDate: DO NOT USE, RATHER USE PROJ OPTIONS; ImagePath: DO NOT USE, RATHER USE PROJ OPTIONS
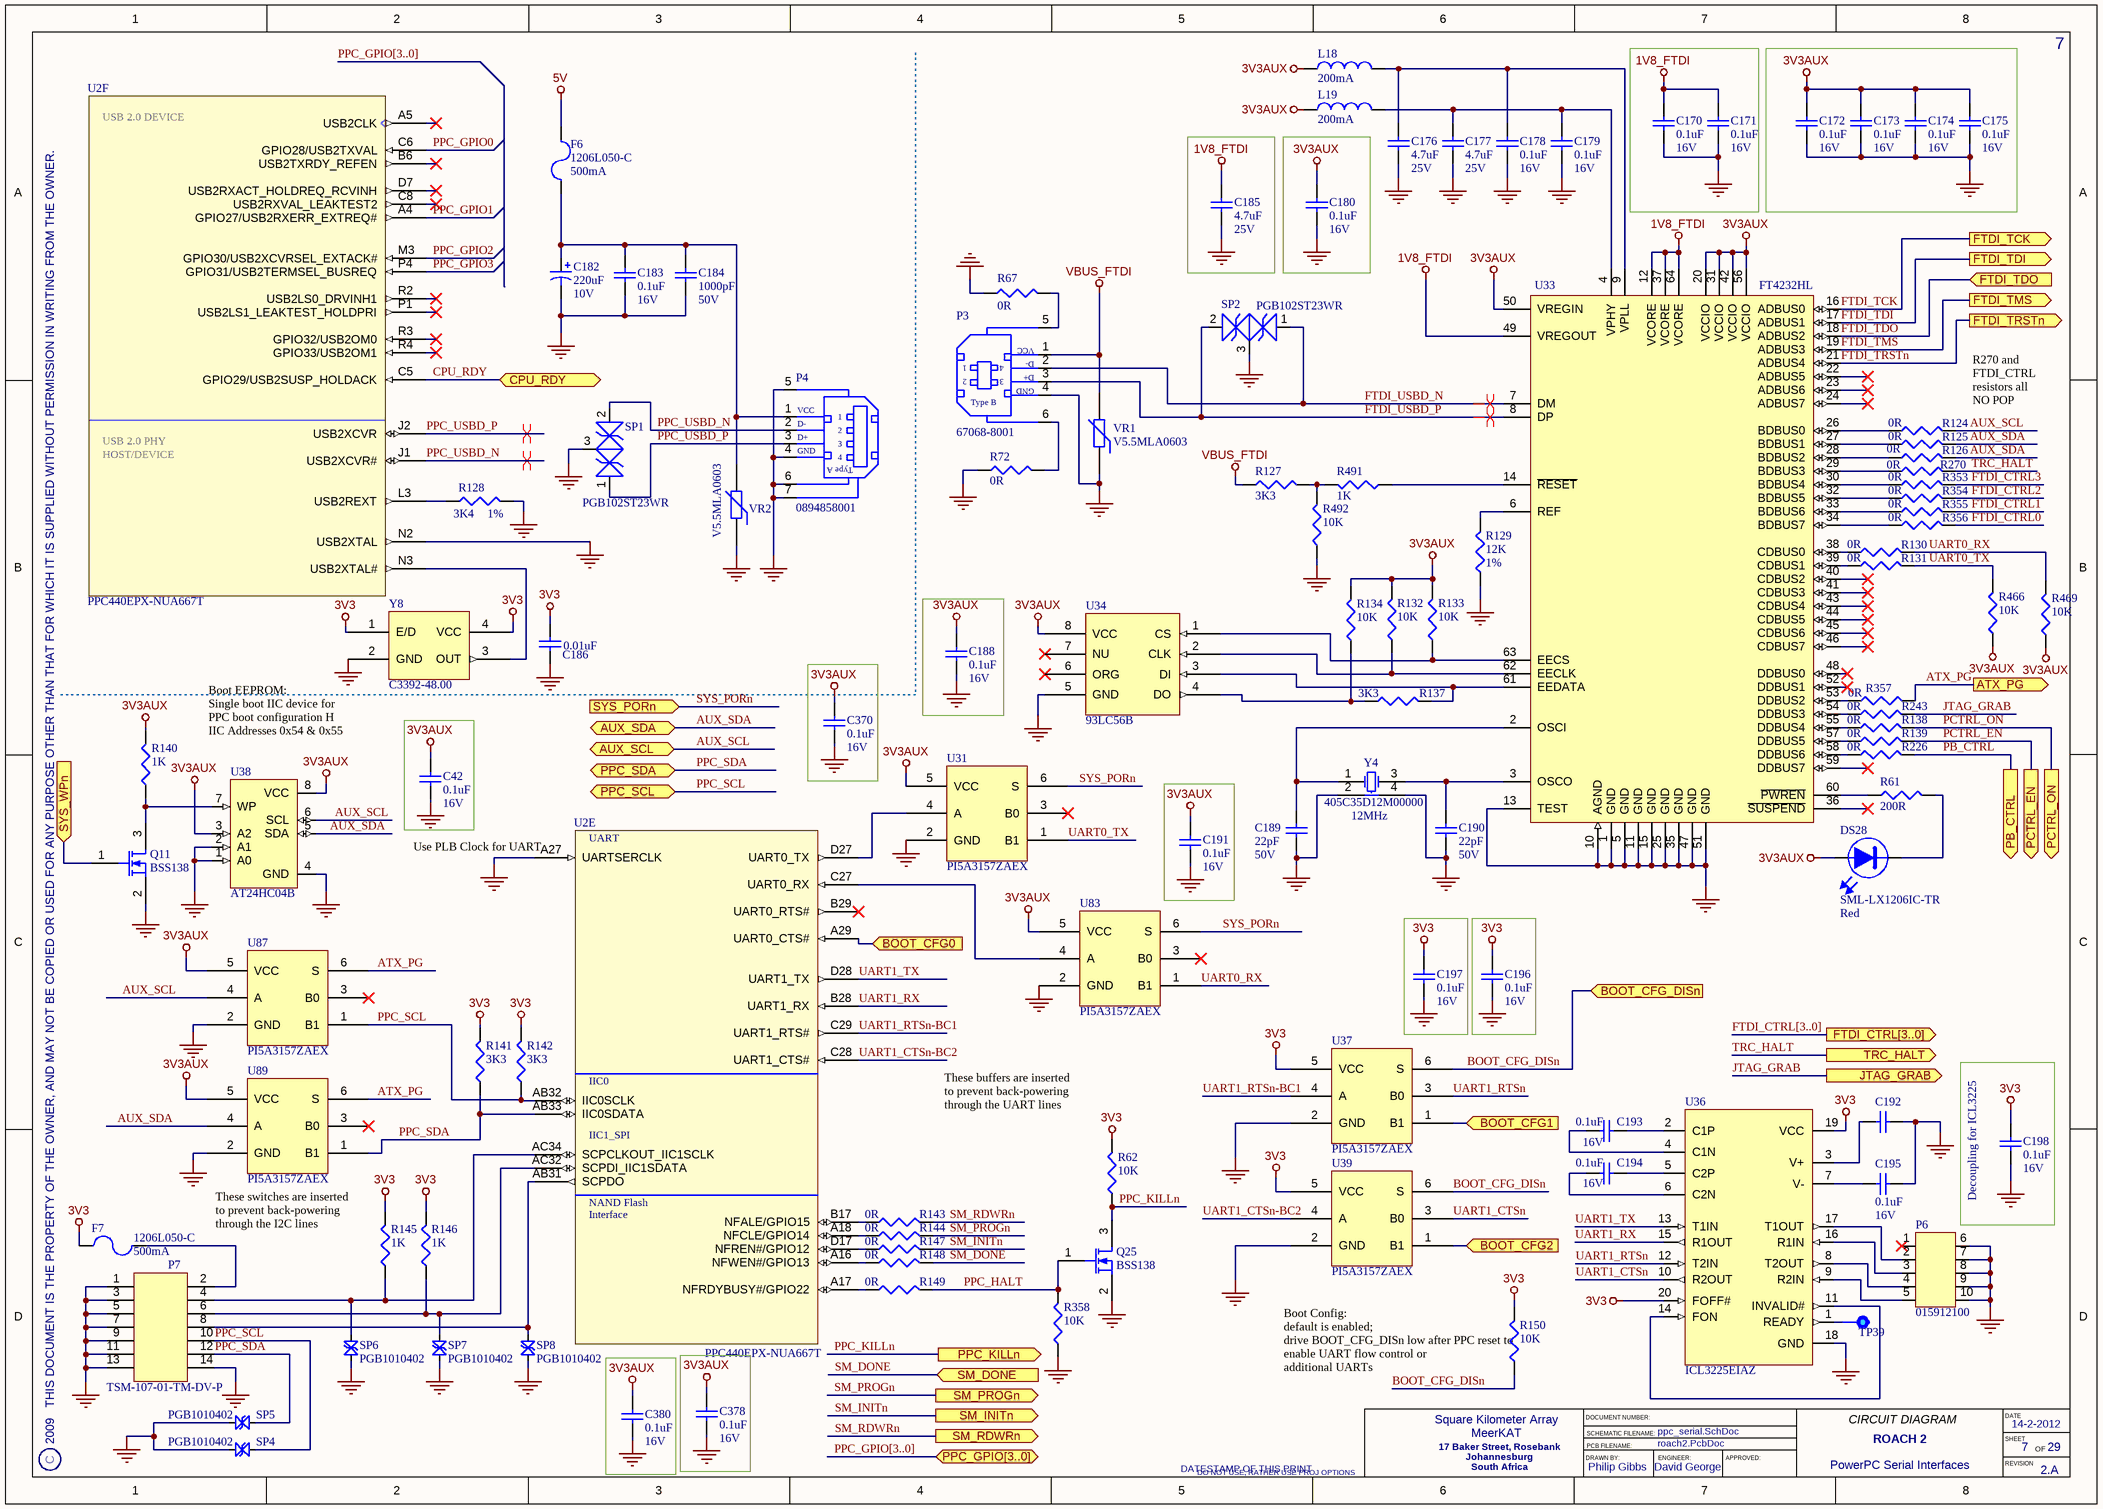
[diagram p9: ppc_serial.SchDoc]

### Parts
C42  Rating: 16V  [CAPC1005X60L]  (hidden comment: 0.1uF)
C170  Rating: 16V  [CAPC1005X60L]  (hidden comment: 0.1uF)
C171  Rating: 16V  [CAPC1005X60L]  (hidden comment: 0.1uF)
C172  Rating: 16V  [CAPC1005X60L]  (hidden comment: 0.1uF)
C173  Rating: 16V  [CAPC1005X60L]  (hidden comment: 0.1uF)
C174  Rating: 16V  [CAPC1005X60L]  (hidden comment: 0.1uF)
C175  Rating: 16V  [CAPC1005X60L]  (hidden comment: 0.1uF)
C176  Rating: 25V  [CAPC2012X127L]  (hidden comment: 4.7uF)
C177  Rating: 25V  [CAPC2012X127L]  (hidden comment: 4.7uF)
C178  Rating: 16V  [CAPC1005X60L]  (hidden comment: 0.1uF)
C179  Rating: 16V  [CAPC1005X60L]  (hidden comment: 0.1uF)
C180  Rating: 16V  [CAPC1005X60L]  (hidden comment: 0.1uF)
C182  Rating: 10V  [CAPMP7343X430L]  (hidden comment: 220uF)
C183  Rating: 16V  [CAPC1005X60L]  (hidden comment: 0.1uF)
C184  Rating: 50V  [CAPC1005X55L]  (hidden comment: 1000pF)
C185  Rating: 25V  [CAPC2012X127L]  (hidden comment: 4.7uF)
C186  0.01uF  [CAPC1005X55L]
C188  Rating: 16V  [CAPC1005X60L]  (hidden comment: 0.1uF)
C189  Rating: 50V  [CAPC1005X55L]  (hidden comment: 22pF)
C190  Rating: 50V  [CAPC1005X55L]  (hidden comment: 22pF)
C191  Rating: 16V  [CAPC1005X60L]  (hidden comment: 0.1uF)
C192  (no value)  [CAPC1005X60L]
C193  Rating: 16V  [CAPC1005X60L]  (hidden comment: 0.1uF)
C194  Rating: 16V  [CAPC1005X60L]  (hidden comment: 0.1uF)
C195  Rating: 16V  [CAPC1005X60L]  (hidden comment: 0.1uF)
C196  Rating: 16V  [CAPC1005X60L]  (hidden comment: 0.1uF)
C197  Rating: 16V  [CAPC1005X60L]  (hidden comment: 0.1uF)
C198  Rating: 16V  [CAPC1005X60L]  (hidden comment: 0.1uF)
C370  Rating: 16V  [CAPC1005X60L]  (hidden comment: 0.1uF)
C378  Rating: 16V  [CAPC1005X60L]  (hidden comment: 0.1uF)
C380  Rating: 16V  [CAPC1005X60L]  (hidden comment: 0.1uF)
DS28  SML-LX1206IC-TR  Colour: Red  [LEDC3216X120N]
F6  Rating: 500mA  [FUSMC3215X145]  (hidden comment: 1206L050-C)
F7  Rating: 500mA  [FUSMC3215X145]  (hidden comment: 1206L050-C)
L18  Rating: 200mA  [INDC2012X130L]  (hidden comment: 600R)
L19  Rating: 200mA  [INDC2012X130L]  (hidden comment: 600R)
P3  67068-8001  [MOLEX_67068-8001]
P4  USB_TYPEA_TYCO  [MOLEX_0894858001]  (value not drawn)
P6  015912100  [MOLEX_0015912100]
P7  TSM-107-01-TM-DV-P  [SAMTEC_TSM-107-01-TM-DV-P]
Q11  BSS138  [SOT95P245X110-3N]
Q25  BSS138  [SOT95P245X110-3N]
R61  200R  [RESC1005X40L]
R62  10K  [RESC1005X40L]
R67  0R  [RESC1005X40L]
R72  0R  [RESC1005X40L]
R124  0R  [RESC1005X40L]
R125  0R  [RESC1005X40L]
R126  0R  [RESC1005X40L]
R127  3K3  [RESC1005X40L]
R128  Tolerance: 1%  [RESC1005X40L]  (hidden comment: 3K4)
R129  Tolerance: 1%  [RESC1005X40L]  (hidden comment: 12K)
R130  0R  [RESC1005X40L]
R131  0R  [RESC1005X40L]
R132  10K  [RESC1005X40L]
R133  10K  [RESC1005X40L]
R134  10K  [RESC1005X40L]
R137  3K3  [RESC1005X40L]
R138  0R  [RESC1005X40L]
R139  0R  [RESC1005X40L]
R140  1K  [RESC1005X40L]
R141  3K3  [RESC1005X40L]
R142  3K3  [RESC1005X40L]
R143  0R  [RESC1005X40L]
R144  0R  [RESC1005X40L]
R145  1K  [RESC1005X40L]
R146  1K  [RESC1005X40L]
R147  0R  [RESC1005X40L]
R148  0R  [RESC1005X40L]
R149  0R  [RESC1005X40L]
R150  10K  [RESC1005X40L]
R226  0R  [RESC1005X40L]
R243  0R  [RESC1005X40L]
R270  0R  [RESC1005X40L]
R353  0R  [RESC1005X40L]
R354  0R  [RESC1005X40L]
R355  0R  [RESC1005X40L]
R356  0R  [RESC1005X40L]
R357  0R  [RESC1005X40L]
R358  10K  [RESC1005X40L]
R466  10K  [RESC1005X40L]
R469  10K  [RESC1005X40L]
R491  1K  [RESC1005X40L]
R492  10K  [RESC1005X40L]
SP1  PGB102ST23WR  [SOT95P245X110-3N]
SP2  PGB102ST23WR  [SOT95P245X110-3N]
SP4  PGB1010402  [PGB1010402]
SP5  PGB1010402  [PGB1010402]
SP6  PGB1010402  [PGB1010402]
SP7  PGB1010402  [PGB1010402]
SP8  PGB1010402  [PGB1010402]
TP39  Testpoint  [TP100]  (value not drawn)  (no BOM)
U2  PPC440EPX-NUA667T  [TE-PBGA680]  (parts E,F of 11)
U31  PI5A3157ZAEX  [SC70-6]
U33  FT4232HL  [QFN64]
U34  93LC56B  [SOIC150-8_N]
U36  ICL3225EIAZ  [SSOP20_M]
U37  PI5A3157ZAEX  [SC70-6]
U38  AT24HC04B  [TSSOP-8A2]
U39  PI5A3157ZAEX  [SC70-6]
U83  PI5A3157ZAEX  [SC70-6]
U87  PI5A3157ZAEX  [SC70-6]
U89  PI5A3157ZAEX  [SC70-6]
VR1  V5.5MLA0603  [VAR_V5_5MLA0603]
VR2  V5.5MLA0603  [VAR_V5_5MLA0603]
Y4  Frequency: 12MHz  [405XXXXXXMXXXXX]  (hidden comment: 405C35D12M00000)
Y8  C3392-48.00  [CB3X-X-XMX]

### Blocks framed on the sheet
Decoupling for ICL3225: C198

### Ports
ATX_PG (out), AUX_SCL (bidir), AUX_SDA (bidir), BOOT_CFG0 (in), BOOT_CFG1 (in), BOOT_CFG2 (in), BOOT_CFG_DISn (in), CPU_RDY (bidir), FTDI_CTRL[3..0] (out), FTDI_TCK (out), FTDI_TDI (out), FTDI_TDO (in), FTDI_TMS (out), FTDI_TRSTn (out), JTAG_GRAB (out), PB_CTRL (out), PCTRL_EN (out), PCTRL_ON (out), PPC_GPIO[3..0] (bidir), PPC_KILLn (out), PPC_SCL (bidir), PPC_SDA (bidir), SM_DONE (in), SM_INITn (out), SM_PROGn (out), SM_RDWRn (out), SYS_PORn (in), SYS_WPn (in), TRC_HALT (out)

### Nets
1V8_FTDI: C170.2 C171.2 C185.2 U33.12(VCORE) U33.37(VCORE) U33.49(VREGOUT) U33.64(VCORE)
3V3: C186.2 C196.2 C197.2 C198.2 F7.2 R62.2 R141.2 R142.2 R145.2 R146.2 R150.2 U36.19(VCC) U36.20(FOFF#) U37.5(VCC) U39.5(VCC) Y8.1(E/D) Y8.4(VCC)
3V3AUX: C42.2 C172.2 C173.2 C174.2 C175.2 C180.2 C188.2 C191.2 C370.2 C378.2 C380.2 DS28.2(A) L18.1 L19.1 R132.2 R133.2 R134.2 R140.2 R466.1 R469.1 U31.5(VCC) U33.20(VCCIO) U33.31(VCCIO) U33.42(VCCIO) U33.50(VREGIN) U33.56(VCCIO) U34.8(VCC) U38.3(A2) U38.8(VCC) U83.5(VCC) U87.5(VCC) U89.5(VCC)
5V: F6.2
GND: C42.1 C170.1 C171.1 C172.1 C173.1 C174.1 C175.1 C176.1 C177.1 C178.1 C179.1 C180.1 C182.2 C183.1 C184.1 C185.1 C186.1 C188.1 C189.1 C190.1 C191.1 C192.1 C195.1 C196.1 C197.1 C198.1 C370.1 C378.1 C380.1 P3.4 P4.4 P4.5 P4.6 P4.7 P6.6 P6.7 P6.8 P6.9 P6.10 P7.1 P7.3 P7.5 P7.7 P7.9 P7.11 P7.13 P7.14 Q11.2(S) Q25.2(S) R67.1 R72.1 R128.2 R129.1 R358.1 R492.1 SP1.3(COM) SP2.3(COM) SP4.2(B) SP5.2(B) SP6.1(A) SP7.1(A) SP8.1(A) U2.A27(UARTSERCLK) U2.N2(USB2XTAL) U31.2(GND) U33.1(GND) U33.5(GND) U33.10(AGND) U33.11(GND) U33.13(TEST) U33.15(GND) U33.25(GND) U33.35(GND) U33.47(GND) U33.51(GND) U34.5(GND) U36.18(GND) U37.2(GND) U38.1(A0) U38.2(A1) U38.4(GND) U39.2(GND) U83.2(GND) U87.2(GND) U89.2(GND) VR1.1 VR2.1 Y4.2 Y4.4 Y8.2(GND)
VBUS_FTDI: P3.1 R127.1 VR1.2
ATX_PG: R357.2 U87.6(S) U89.6(S) ; port ATX_PG
AUX_SCL: R124.2 U38.6(SCL) U87.4(A) ; port AUX_SCL
AUX_SDA: R125.2 R126.2 U38.5(SDA) U89.4(A) ; port AUX_SDA
BOOT_CFG0: U2.A29(UART0_CTS#) ; port BOOT_CFG0
BOOT_CFG1: U37.1(B1) ; port BOOT_CFG1
BOOT_CFG2: U39.1(B1) ; port BOOT_CFG2
BOOT_CFG_DISn: R150.1 U37.6(S) U39.6(S) ; port BOOT_CFG_DISn
CPU_RDY: U2.C5(GPIO29/USB2SUSP_HOLDACK) ; port CPU_RDY
FTDI_CTRL0: R356.2
FTDI_CTRL1: R355.2
FTDI_CTRL2: R354.2
FTDI_CTRL3: R353.2
FTDI_TCK: U33.16(ADBUS0) ; port FTDI_TCK
FTDI_TDI: U33.17(ADBUS1) ; port FTDI_TDI
FTDI_TDO: U33.18(ADBUS2) ; port FTDI_TDO
FTDI_TMS: U33.19(ADBUS3) ; port FTDI_TMS
FTDI_TRSTn: U33.21(ADBUS4) ; port FTDI_TRSTn
FTDI_USBD_N: P3.2 SP2.1(A) U33.7(DM)
FTDI_USBD_P: P3.3 SP2.2(B) U33.8(DP)
JTAG_GRAB: R243.2 ; port JTAG_GRAB
PB_CTRL: R226.2 ; port PB_CTRL
PCTRL_EN: R139.2 ; port PCTRL_EN
PCTRL_ON: R138.2 ; port PCTRL_ON
PPC_GPIO0: U2.C6(GPIO28/USB2TXVAL)
PPC_GPIO1: U2.A4(GPIO27/USB2RXERR_EXTREQ#)
PPC_GPIO2: U2.M3(GPIO30/USB2XCVRSEL_EXTACK#)
PPC_GPIO3: U2.P4(GPIO31/USB2TERMSEL_BUSREQ)
PPC_HALT: Q25.1(G) R149.2 R358.2
PPC_KILLn: Q25.3(D) R62.1 ; port PPC_KILLn
PPC_SCL: P7.10 R142.1 SP4.1(A) U2.AB32(IIC0SCLK) U87.1(B1) ; port PPC_SCL
PPC_SDA: P7.12 R141.1 SP5.1(A) U2.AB33(IIC0SDATA) U89.1(B1) ; port PPC_SDA
PPC_USBD_N: P4.2 SP1.2(B) U2.J1(USB2XCVR#)
PPC_USBD_P: P4.3 SP1.1(A) U2.J2(USB2XCVR)
SM_DONE: R148.2 ; port SM_DONE
SM_INITn: R147.2 ; port SM_INITn
SM_PROGn: R144.2 ; port SM_PROGn
SM_RDWRn: R143.2 ; port SM_RDWRn
SYS_PORn: U31.6(S) U83.6(S) ; port SYS_PORn
SYS_WPn: Q11.1(G) ; port SYS_WPn
TRC_HALT: R270.2 ; port TRC_HALT
UART0_RX: R130.2 R469.2 U83.1(B1)
UART0_TX: R131.2 R466.2 U31.1(B1)
UART1_CTSn: U36.10(R2OUT) U39.3(B0)
UART1_CTSn-BC2: U2.C28(UART1_CTS#) U39.4(A)
UART1_RTSn: U36.12(T2IN) U37.3(B0)
UART1_RTSn-BC1: U2.C29(UART1_RTS#) U37.4(A)
UART1_RX: U2.B28(UART1_RX) U36.15(R1OUT)
UART1_TX: U2.D28(UART1_TX) U36.13(T1IN)
NetC176_2: C176.2 C178.2 L18.2 U33.9(VPLL)
NetC177_2: C177.2 C179.2 L19.2 U33.4(VPHY)
NetC182_1: C182.1 C183.2 C184.2 F6.1 P4.1 VR2.2
NetC189_2: C189.2 U33.2(OSCI) Y4.1
NetC190_2: C190.2 U33.3(OSCO) Y4.3
NetC192_2: C192.2 U36.3(V+)
NetC193_1: C193.1 U36.2(C1P)
NetC193_2: C193.2 U36.4(C1N)
NetC194_1: C194.1 U36.5(C2P)
NetC194_2: C194.2 U36.6(C2N)
NetC195_2: C195.2 U36.7(V-)
NetDS28_1: DS28.1(K) R61.2
NetF7_1: F7.1 P7.2
NetP3_5: P3.5 R67.2
NetP3_6: P3.6 R72.2
NetP6_2: P6.2 U36.17(T1OUT)
NetP6_3: P6.3 U36.16(R1IN)
NetP6_4: P6.4 U36.8(T2OUT)
NetP6_5: P6.5 U36.9(R2IN)
NetP7_4: P7.4 R145.1 SP6.2(B) U2.AC34(SCPCLKOUT_IIC1SCLK)
NetP7_6: P7.6 R146.1 SP7.2(B) U2.AC32(SCPDI_IIC1SDATA)
NetP7_8: P7.8 SP8.2(B) U2.AB31(SCPDO)
NetQ11_3: Q11.3(D) R140.1 U38.7(WP)
NetR61_1: R61.1 U33.60(~{PWREN})
NetR124_1: R124.1 U33.26(BDBUS0)
NetR125_1: R125.1 U33.27(BDBUS1)
NetR126_1: R126.1 U33.28(BDBUS2)
NetR127_2: R127.2 R491.2 R492.2
NetR128_1: R128.1 U2.L3(USB2REXT)
NetR129_2: R129.2 U33.6(REF)
NetR130_1: R130.1 U33.38(CDBUS0)
NetR131_1: R131.1 U33.39(CDBUS1)
NetR132_1: R132.1 U33.62(EECLK) U34.2(CLK)
NetR133_1: R133.1 U33.63(EECS) U34.1(CS)
NetR134_1: R134.1 R137.1 U34.4(DO)
NetR137_2: R137.2 U33.61(EEDATA) U34.3(DI)
NetR138_1: R138.1 U33.55(DDBUS4)
NetR139_1: R139.1 U33.57(DDBUS5)
NetR143_1: R143.1 U2.B17(NFALE/GPIO15)
NetR144_1: R144.1 U2.A18(NFCLE/GPIO14)
NetR147_1: R147.1 U2.D17(NFREN#/GPIO12)
NetR148_1: R148.1 U2.A16(NFWEN#/GPIO13)
NetR149_1: R149.1 U2.A17(NFRDYBUSY#/GPIO22)
NetR226_1: R226.1 U33.58(DDBUS6)
NetR243_1: R243.1 U33.54(DDBUS3)
NetR270_1: R270.1 U33.29(BDBUS3)
NetR353_1: R353.1 U33.30(BDBUS4)
NetR354_1: R354.1 U33.32(BDBUS5)
NetR355_1: R355.1 U33.33(BDBUS6)
NetR356_1: R356.1 U33.34(BDBUS7)
NetR357_1: R357.1 U33.53(DDBUS2)
NetR491_1: R491.1 U33.14(~{RESET})
NetTP39_1: TP39.1 U36.1(READY)
NetU2_C27: U2.C27(UART0_RX) U83.4(A)
NetU2_D27: U2.D27(UART0_TX) U31.4(A)
NetU2_N3: U2.N3(USB2XTAL#) Y8.3(OUT)
NetU36_11: U36.11(INVALID#) U36.14(FON)

Not connected (* = marked no-connect by the designer): P6 1*; U2 A5(USB2CLK)* B6(USB2TXRDY_REFEN)* B29(UART0_RTS#)* C8(USB2RXVAL_LEAKTEST2)* D7(USB2RXACT_HOLDREQ_RCVINH)* P1(USB2LS1_LEAKTEST_HOLDPRI)* R2(USB2LS0_DRVINH1)* R3(GPIO32/USB2OM0)* R4(GPIO33/USB2OM1)*; U31 3(B0)*; U33 22(ADBUS5)* 23(ADBUS6)* 24(ADBUS7)* 36(~{SUSPEND})* 40(CDBUS2)* 41(CDBUS3)* 43(CDBUS4)* 44(CDBUS5)* 45(CDBUS6)* 46(CDBUS7)* 48(DDBUS0)* 52(DDBUS1)* 59(DDBUS7)*; U34 6(ORG)* 7(NU)*; U83 3(B0)*; U87 3(B0)*; U89 3(B0)*

### Buses and harness runs
bus FTDI_CTRL[3..0] = port FTDI_CTRL[3..0]
bus PPC_GPIO[3..0]
bus PPC_GPIO[3..0] = port PPC_GPIO[3..0]

### Layout directives
differential pair: FTDI_USBD_N, FTDI_USBD_P, PPC_USBD_N, PPC_USBD_P

### Notes on the sheet
- R270 and FTDI_CTRL resistors all NO POP
- Boot EEPROM:
  Single boot IIC device for
  PPC boot configuration H
  IIC Addresses 0x54 & 0x55
- (near U2) Use PLB Clock for UART
- (near R62) These buffers are inserted
  to prevent back-powering
  through the UART lines
- These switches are inserted
  to prevent back-powering
  through the I2C lines
- (near R150) Boot Config:
  default is enabled;
  drive BOOT_CFG_DISn low after PPC reset to
  enable UART flow control or
  additional UARTs
- 2009   THIS DOCUMENT IS THE PROPERTY OF THE OWNER, AND MAY NOT BE COPIED OR USED FOR ANY PURPOSE OTHER THAN THAT FOR WHICH IT IS SUPPLIED WITHOUT PERMISSION IN WRITING FROM THE OWNER.
- C
- DATESTAMP OF THIS PRINT
- DRAWN BY:
- DOCUMENT NUMBER:
- SCHEMATIC FILENAME:
- PCB FILENAME:
- ENGINEER:
- APPROVED:
- CIRCUIT DIAGRAM
- DATE
- SHEET
- REVISION
- OF
- (in symbol CONN-PCB-18) VCC; D-; D+; GND; Type A
- (in symbol CONN-PCB-25) VCC; D-; D+; GND; Type B
- (in symbol IC-CPU-1, part E) UART; IIC0; IIC1_SPI; NAND Flash; Interface
- (in symbol IC-CPU-1, part F) USB 2.0 DEVICE; USB 2.0 PHY; HOST/DEVICE

### Library data of the parts
C42 C170-C175 C178-C180 C183 C188 C191-C198 C370 C378 C380 = CAP-CER-1: as C166-C168 on sheet ppc_extbus; POD number: CAP-CER-1; RoHS: Y; Sort Value: 0.1; Category: Capacitors; Subcategory: Ceramic
  C42 C170-C175 C178-C180 C183 C188 C191 C193-C198 C370 C378 C380: Value: 0.1uF
C176 C177 C185 = CAP-CER-3: 4.7uF, Ceramic Capacitor; Manufacturer: MURATA; PartNum: GRM21BR61E475KA12K; Tolerance: 10%; Dielectric: X5R; POD number: CAP-CER-3; Value: 4.7uF; RoHS: Y; Sort Value: 4.7; Category: Capacitors; Subcategory: Ceramic
C182 = CAP-TAN-0: 220uF, Solid Tantalum Chip Capacitor; Manufacturer: KEMET; PartNum: T491X227M010AT; Tolerance: 20%; ESR: 0.5; POD number: CAP-TAN-0; Value: 220uF; RoHS: Y; Sort Value: 220; Category: Capacitors; Subcategory: Tantalum
C184 = CAP-CER-4: as C275 on sheet ppc_net; POD number: CAP-CER-4; Value: 1000pF; RoHS: Y; Sort Value: 0.0001; Category: Capacitors; Subcategory: Ceramic
C186 = CAP-CER-6: 0.01uF, Ceramic Capacitor; Manufacturer: MURATA; PartNum: GRM155R71E103KA01D; Tolerance: 10%; Rating: 25V; Dielectric: X7R; POD number: CAP-CER-6; RoHS: Y; Value: 0.01uF; Sort Value: 0.01; Category: Capacitors; Subcategory: Ceramic
C189 C190 = CAP-CER-2: 22pF, Ceramic Capacitor; Manufacturer: MURATA; PartNum: GRM1555C1H220JA01D; Tolerance: 5%; Dielectric: C0G; POD number: CAP-CER-2; Value: 22pF; RoHS: Y; Sort Value: 0.000022; Category: Capacitors; Subcategory: Ceramic
DS28 = OPTO-LED-1: Red, Surface mount, LED, 1206; Manufacturer: LUMEX; Vdrop: 2V; Rating: 20mA; POD number: OPTO-LED-1; PartNum: SML-LX1206IC-TR; RoHS: Y; Category: OPTO; Subcategory: LED
F6 F7 = ELMECH-FUSE-0: Resettable, Surface mount Fuse; Manufacturer: Littelfuse; POD number: ELMECH-FUSE-0; PartNum: 1206L050-C; RoHS: Y; Category: ELMECH; Subcategory: Fuses
L18 L19 = IND-FB-0: as L21 on sheet ppc_net; POD number: IND-FB-0; RoHS: Y; Value: 600R; Sort Value: 600; Category: Inductors; Subcategory: FerriteBead
P3 = CONN-PCB-25: Right angle, Through-hole, USB Type B Receptacle; Manufacturer: Molex; POD number: CONN-PCB-25; PartNum: 67068-8001; RoHS: Y; Category: CONN; Subcategory: PCB
P4 = CONN-PCB-18: Right angle, Through-hole, USB Type A Receptacle; POD number: CONN-PCB-18; PartNum: 0894858001
P6 = CONN-PCB-12: 2x5, 2.54 mm Pitch, Male Header; Manufacturer: Molex; POD number: CONN-PCB-12; PartNum: 015912100; RoHS: Y; Category: CONN; Subcategory: PCB
P7 = CONN-PCB-16: 2x7, 2.54 mm Pitch, Male Header; Manufacturer: SAMTEC; POD number: CONN-PCB-16; PartNum: TSM-107-01-TM-DV-P; RoHS: Y; Category: CONN; Subcategory: PCB
Q11 Q25 = TRANS-NFET-0: N-Channel Logic Level Enhancement Mode Field Effect Transistor; Manufacturer: Fairchild Semiconductor; Rating: 0.22A; POD number: TRANS-NFET-0; PartNum: BSS138; RoHS: Y; Category: TRANS; Subcategory: NFET
R61 = RES-TF-19: as R123 on sheet ppc_extbus; POD number: RES-TF-19; Value: 200R; Sort Value: 200; Category: Resistors; Subcategory: ThickFilm; HelpURL: *.pdf
R62 R132-R134 R150 R358 R466 R469 R492 = RES-TF-5: as R235 on sheet ppc_net; POD number: RES-TF-5; Value: 10K; Sort Value: 10000; Category: Resistors; Subcategory: ThickFilm; HelpURL: *.pdf
R67 R72 R124-R126 R130 R131 R138 R139 R143 R144 R147-R149 R226 R243 R270 R353-R357 = RES-TF-0: as R105 on sheet ppc_extbus; POD number: RES-TF-0; Value: 0R; Sort Value: 0; Category: Resistors; Subcategory: ThickFilm
  R67 R72 R124-R126 R130 R131 R138 R139 R143 R144 R147-R149 R226 R243 R270 R353-R356: HelpURL: *.pdf
  R357: RoHS: Y; HelpURL: http://www.royalohm.com/pdf/general.pdf
R127 R137 R141 R142 = RES-TF-7: as R97-R104 on sheet ppc_extbus; POD number: RES-TF-7; Value: 3K3; Sort Value: 3300; Category: Resistors; Subcategory: ThickFilm
  R127 R137: HelpURL: *.pdf
  R141 R142: RoHS: Y; HelpURL: http://www.royalohm.com/pdf/general.pdf
R128 = RES-TF-2: 3K4, 1.1mm x 0.5mm, Thick Film Resistor; Manufacturer: ROYALOHM; PartNum: 0402WGF0342T1E; Rating: 0.0625W; POD number: RES-TF-2; Value: 3K4; Sort Value: 3400; Category: Resistors; Subcategory: ThickFilm; HelpURL: *.pdf
R129 = RES-TF-3: 12K, 1.1mm x 0.5mm, Thick Film Resistor; Manufacturer: ROYALOHM; PartNum: 0402WGF0123T1E; Rating: 0.0625W; POD number: RES-TF-3; Value: 12K; Sort Value: 12000; Category: Resistors; Subcategory: ThickFilm; HelpURL: *.pdf
R140 R145 R146 R491 = RES-TF-8: as R111 on sheet ppc_extbus; POD number: RES-TF-8; Value: 1K; Sort Value: 1000; Category: Resistors; Subcategory: ThickFilm; HelpURL: *.pdf
SP1 SP2 = ELMECH-ESD-4: Ultra-low Capacitance, Surface mount ESD Suppressor; Manufacturer: Littelfuse; POD number: ELMECH-ESD-4; PartNum: PGB102ST23WR; RoHS: Y; Category: ELMECH; Subcategory: ESD Suppressors
SP4-SP8 = ELMECH-ESD-3: as SP9-SP16 on sheet ppc_net; POD number: ELMECH-ESD-3; PartNum: PGB1010402
TP39 = ELMECH-TP-0: as TP28 on sheet ppc_extbus; POD number: ELMECH-TP-0; RoHS: Y; Category: ELMECH; Subcategory: Test Points
U2 = IC-CPU-1: as U2 on sheet ppc_extbus; POD number: IC-CPU-1; PartNum: PPC440EPX-NUA667T; RoHS: Y; Category: IC; Subcategory: CPU
U31 U37 U39 U83 U87 U89 = IC-LOG-5: Low voltage SPDT Analogue Switch; Manufacturer: PERICOM; POD number: IC-LOG-5; PartNum: PI5A3157ZAEX; RoHS: Y; Category: IC; Subcategory: Logic
U33 = IC-IF-0: Quad High Speed USB to Multipurpose UART/MPSSE; Manufacturer: FTDI; POD number: IC-IF-0; PartNum: FT4232HL; RoHS: Y; Category: IC; Subcategory: Interface
U34 = IC-MEM-3: 2K Microwire Compatible Serial EEPROM; Manufacturer: Microchip; PartNum: 93LC56B/SN; POD number: IC-MEM-3; RoHS: Y; Category: IC; Subcategory: Memory
U36 = IC-LOG-9: Low-power RS232 transceivers; Manufacturer: Intersil; POD number: IC-LOG-9; PartNum: ICL3225EIAZ; RoHS: Y; Category: IC; Subcategory: Logic
U38 = IC-MEM-4: 4K Serial EEPROM; Manufacturer: Atmel; POD number: IC-MEM-4; PartNum: AT24HC04B; RoHS: Y; Category: IC; Subcategory: Memory
VR1 VR2 = ELMECH-ESD-2: Multilayer Transient Voltage Surge Suppressing Varistor; Manufacturer: Littelfuse; POD number: ELMECH-ESD-2; PartNum: V5.5MLA0603; RoHS: Y; Category: ELMECH; Subcategory: ESD Suppressors
Y4 = RESN-XTAL-4: 12 MHz, Surface mount, Crystal Oscillator; Manufacturer: CTS; Stability: 50 PPM; Load Capacitance: 18 pF; POD number: RESN-XTAL-4; PartNum: 405C35D12M00000; RoHS: Y; Category: RESN; Subcategory: Crystal Oscillator
Y8 = RESN-CLK-7: 48 MHz, 3V3, Surface mount, Clock Oscillator; Manufacturer: Crystek; Frequency: 48MHz; Stability: 50 PPM; POD number: RESN-CLK-7; PartNum: C3392-48.00; RoHS: Y; Category: RESN; Subcategory: Clock Oscillators